# EAGLE design ZeroCrossPower (EAGLE 6.5.0)
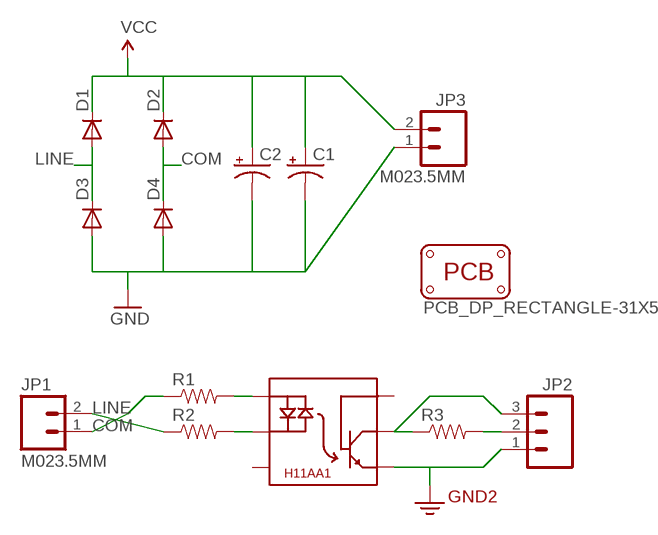
[diagram p0: schematic, sheet 1]

## Parts
C1  CAP_POLPTH3  [CPOL-RADIAL-1000UF-63V]
C2  CAP_POLPTH4  [CPOL-RADIAL-1000UF-25V]
D1  DIODE  [DIODE-1N4001-KIT]
D2  DIODE  [DIODE-1N4001-KIT]
D3  DIODE  [DIODE-1N4001-KIT]
D4  DIODE  [DIODE-1N4001-KIT]
JP1  M023.5MM  [SCREWTERMINAL-3.5MM-2]
JP2  M03PTH  [1X03]
JP3  M023.5MM  [SCREWTERMINAL-3.5MM-2]
PCB1  PCB_DP_RECTANGLE-31X50  [DP5031_V1]
R1  RESISTORAXIAL-0.3  [AXIAL-0.3]
R2  RESISTORAXIAL-0.3  [AXIAL-0.3]
R3  RESISTORAXIAL-0.3  [AXIAL-0.3]
U$1  H11AA1  [DIP6]

## Nets
3.3V: JP2.1 U$1.4(E) ; supply symbol labelled GND2
AC: R1.P$2 U$1.1(A/C)
CA: R2.P$2 U$1.2(C/A)
COM: D2.A D4.C JP1.2 R2.P$1
GND: C1.2(-) C2.2(-) D3.A D4.A JP3.1
LINE: D1.A D3.C JP1.1 R1.P$1
N$2: JP2.2 R3.P$2
N$3: JP2.3 R3.P$1 U$1.5(C)
VCC: C1.1(+) C2.1(+) D1.C D2.C JP3.2
Unconnected: U$1.3(NC) U$1.6(B)

## Library data of the parts
C1 C2 = barbary_enterprises:CAP_POL: Capacitor Polarized These are standard SMD and PTH capacitors. Normally 10uF, 47uF, and 100uF in electrolytic and tantalum varieties. Always verify the external diameter of the through hole cap, it varies with capacity, voltage, and manufacturer. The EIA devices should be standard.
D1-D4 = SparkFun-DiscreteSemi:DIODE: Diode These are standard reverse protection diodes and small signal diodes. SMA package can handle up to about 1A. SOD-323 can handle about 200mA. What the SOD-323 package when ordering, there are some mfgs out there that are 5-pin packages.
JP1 JP3 = SparkFun-Connectors:M02: Standard 2-pin 0.1" header. Use with - straight break away headers ( PRT-00116) - right angle break away headers (PRT-00553) - swiss pins (PRT-00743) - machine pins (PRT-00117) - female headers (PRT-00115) Molex polarized connector foot print use with: PRT-08233 with associated crimp pins and housings. 2.54_SCREWTERM for use with PRT-10571. 3.5mm Screw Terminal footprints for PRT-08084 5mm Screw Terminal footprints for use with PRT-08433
JP2 = SparkFun-Connectors:M03: Header 3 Standard 3-pin 0.1" header. Use with straight break away headers (SKU : PRT-00116), right angle break away headers (PRT-00553), swiss pins (PRT-00743), machine pins (PRT-00117), and female headers (PRT-00115). Molex polarized connector foot print use with SKU : PRT-08232 with associated crimp pins and housings.
PCB1 = dp_pcb:PCB_DP_RECTANGLE: Dangerous Prototypes Standard Rectangular PCB sizes
R1-R3 = barbary_enterprises:RESISTOR: Resistor Basic schematic elements and footprints for 0603, 1206, and PTH resistors.
U$1 = barbary_enterprises:H11AA1

## Board
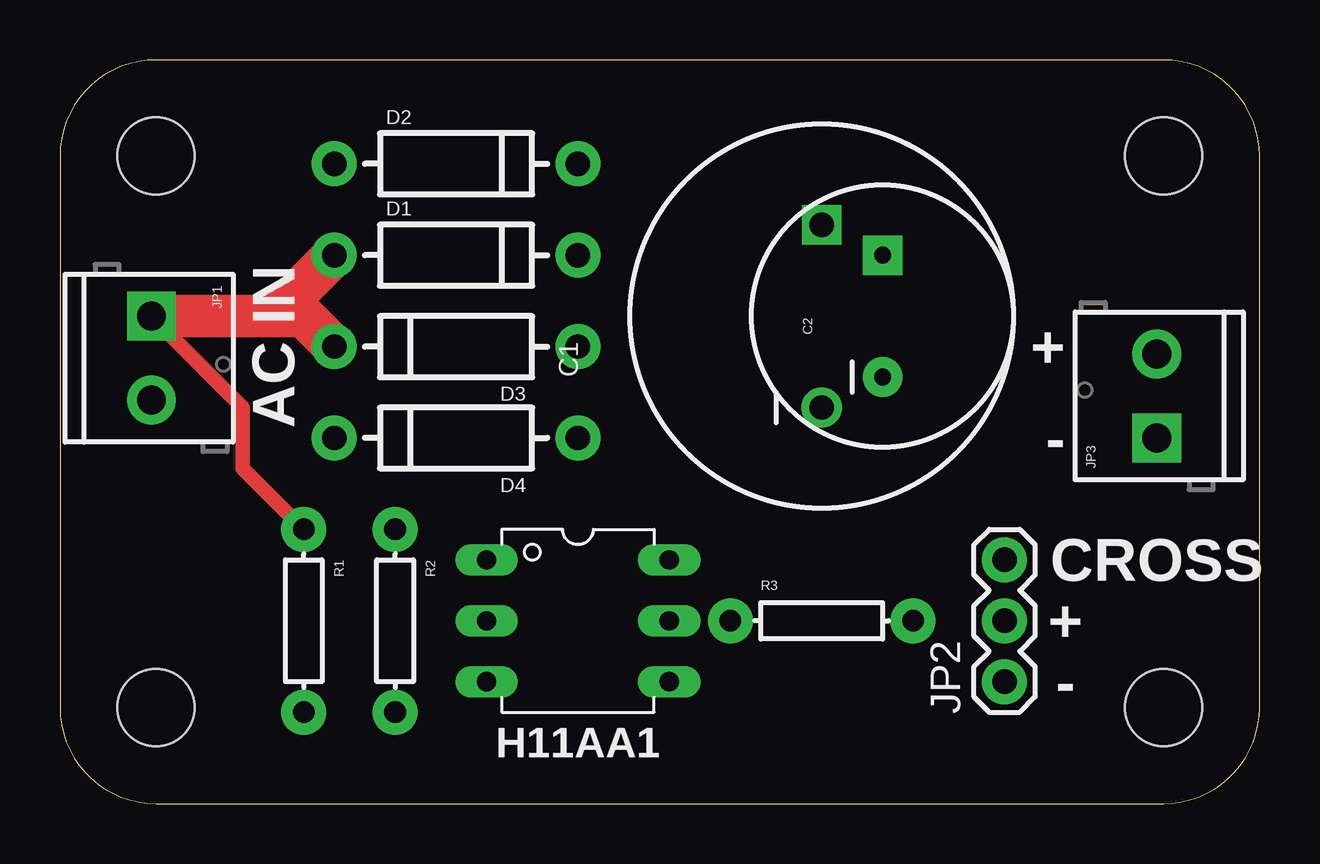
[diagram p1: board, top side]
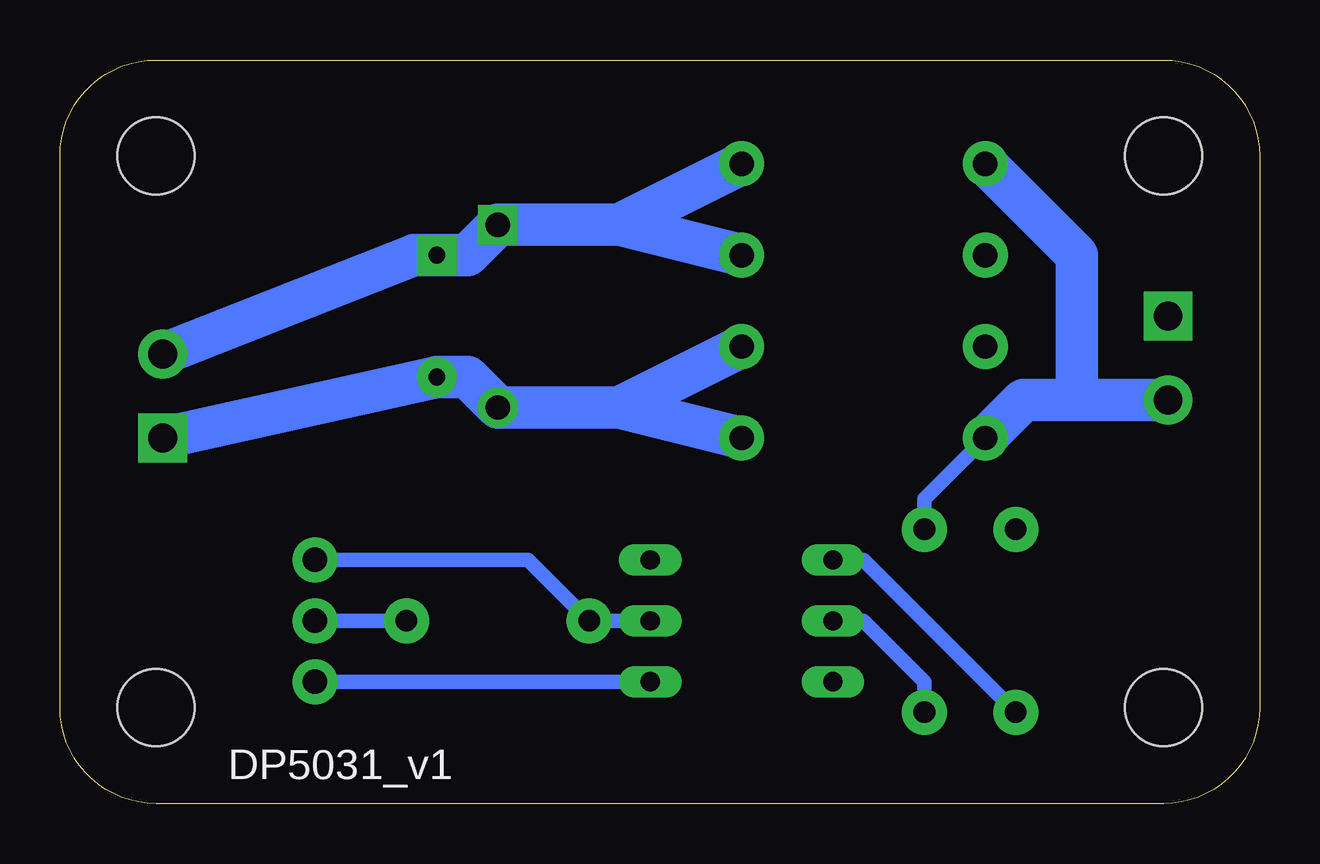
[diagram p2: board, bottom side, seen from below]

Size 50 x 31 mm. Coordinates in mm from the lower left corner, seen from the top.
Copper layers (1*16): Top 0.035mm / dielectric 1.5mm / Bottom 0.035mm
Design rules "default": minimum track width 10mil, minimum drill 24mil, track to track 8mil, track to pad 8mil, pad to pad 8mil, via to via 8mil, smd to smd 8mil, copper to edge 40mil, drill to drill 8mil, minimum pad ring 10mil, minimum via ring 8mil, stop-mask expansion 4mil, vias tented up to drill 0mil, thermal gap 10mil

### Footprints (pad centres in the part's own frame; a part is rotated, then mirrored left to right if it is on the bottom)
CPOL-RADIAL-1000UF-63V = drill 1.016 pad 1.651 square: 1 3.81,0 | drill 1.016 pad 1.676: 2 -3.81,0
CPOL-RADIAL-1000UF-25V = drill 0.7 pad 1.651 square: 1 2.54,0 | drill 0.7 pad 1.651: 2 -2.54,0
DIODE-1N4001-KIT = drill 1.016 pad 1.88: A -5.08,0; C 5.08,0
SCREWTERMINAL-3.5MM-2 = drill 1.2 pad 2.032 square: 1 0,0 | drill 1.2 pad 2.032: 2 3.5,0
1X03 = drill 1.016 pad 1.88: 1 0,0; 2 2.54,0; 3 5.08,0
DP5031_V1 = hole 3.2: 4,4; 46,4; 46,27; 4,27
AXIAL-0.3 = drill 0.9 pad 1.88: P$1 -3.81,0; P$2 3.81,0
DIP6 = drill 0.8 long: 1 -3.81,2.54; 2 -3.81,0; 3 -3.81,-2.54; 4 3.81,-2.54; 5 3.81,0; 6 3.81,2.54

### Placement (x,y rotation side)
C1  31.75,20.32 90 top
C2  34.29,20.32 90 top
D1  16.51,22.86 0 top
D2  16.51,26.67 0 top
D3  16.51,19.05 180 top
D4  16.51,15.24 180 top
JP1  3.81,20.32 270 top
JP2  39.37,5.08 90 top
JP3  45.72,15.24 90 top
PCB1  0,0 0 top
R1  10.16,7.62 270 top
R2  13.97,7.62 270 top
R3  31.75,7.62 0 top
U$1  21.59,7.62 0 top

### Tracks (layer width: path | path; a pad name or v marks a point on that pad's centre or on a via)
3.3V
  Bottom 0.61: U$1.4 JP2.1
AC
  Bottom 0.61: U$1.1 16.51,10.16 R1.P$2
CA
  Bottom 0.61: R2.P$2 13.97,5.08 16.51,7.62 U$1.2
COM
  Bottom 0.61: R2.P$1 13.97,12.7 D4.C
  Bottom 1.778: JP1.2 7.62,16.82 | 7.62,16.82 9.85,16.82 D4.C | 7.62,16.82 7.62,22.86 D2.A
GND
  Bottom 1.778: 26.67,16.51 C1.2 33.02,17.78 C2.2 JP3.1 | 26.67,16.51 D3.A | D4.A 26.67,16.51
LINE
  Top 0.61: R1.P$1 7.62,13.97 7.62,16.51 JP1.1
  Top 1.778: JP1.1 8.89,20.32 | 8.89,20.32 10.16,20.32 D3.C | D1.A 8.89,20.32
N$2
  Bottom 0.61: R3.P$2 JP2.2
N$3
  Bottom 0.61: U$1.5 R3.P$1 30.48,10.16 JP2.3
VCC
  Bottom 1.778: D1.C 26.67,24.13 | 26.67,24.13 C1.1 33.02,22.86 C2.1 35.25,22.86 JP3.2 | D2.C 26.67,24.13

### Text on the board
tPlace: AC IN | + | - | CROSS | + | - | H11AA1